# EAGLE design Ultraschall Sensoren_85_SMD (EAGLE 7.2.0)
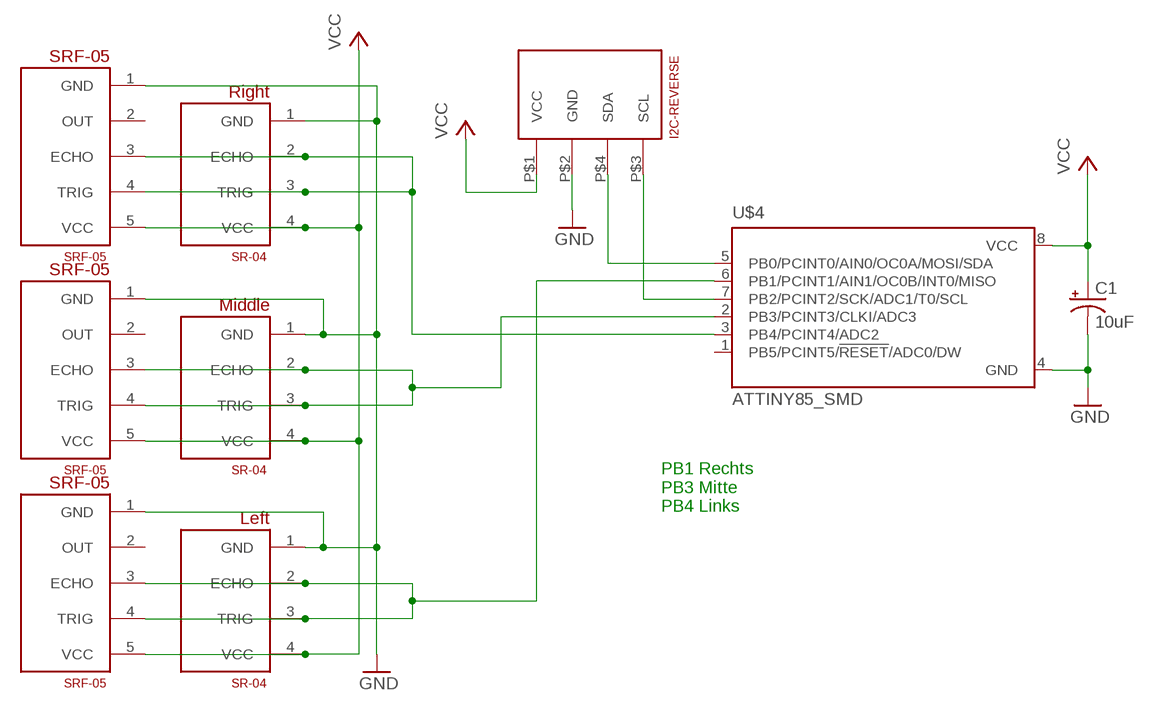
[diagram p0: schematic, sheet 1]

## Parts
C1  10uF  10UF-TANT  [EIA3216]
LINKS  Left  SR-04  [HC-SR04]
MIDDLE  Middle  SR-04  [HC-SR04]
RIGHT  Right  SR-04  [HC-SR04]
U$1  SRF-05  [SRF-05]
U$2  I2C-REVERSE  [I2C-CONNECTOR]
U$3  SRF-05  [SRF-05]
U$4  ATTINY85_SMD  [ATTINY85_SMD]
U$5  SRF-05  [SRF-05]

## Nets
GND: C1.C(-) LINKS.1(GND) MIDDLE.1(GND) RIGHT.1(GND) U$1.1(GND) U$2.P$2(GND) U$3.1(GND) U$4.4(GND) U$5.1(GND)
N$1: RIGHT.2(ECHO) RIGHT.3(TRIG) U$1.3(ECHO) U$1.4(TRIG) U$4.3(PB4/PCINT4/ADC2)
N$2: MIDDLE.2(ECHO) MIDDLE.3(TRIG) U$3.3(ECHO) U$3.4(TRIG) U$4.2(PB3/PCINT3/CLKI/ADC3)
N$4: U$2.P$3(SCL) U$4.7(PB2/PCINT2/SCK/ADC1/T0/SCL)
N$5: U$2.P$4(SDA) U$4.5(PB0/PCINT0/AIN0/OC0A/MOSI/SDA)
N$6: LINKS.2(ECHO) LINKS.3(TRIG) U$4.6(PB1/PCINT1/AIN1/OC0B/INT0/MISO) U$5.3(ECHO) U$5.4(TRIG)
VCC: C1.A(+) LINKS.4(VCC) MIDDLE.4(VCC) RIGHT.4(VCC) U$1.5(VCC) U$2.P$1(VCC) U$3.5(VCC) U$4.8(VCC) U$5.5(VCC)
Unconnected: U$1.2(OUT) U$3.2(OUT) U$4.1(PB5/PCINT5/!RESET!/ADC0/DW) U$5.2(OUT)

## Notes on the sheet
- PB1 Rechts
  PB3 Mitte
  PB4 Links

## Library data of the parts
C1 = SparkFun-Retired:10UF-TANT: 10uF Tantalum SMT CAP-00811- 16V 10% (EIA-3216); PROD_ID: CAP-00811
LINKS MIDDLE RIGHT = ASP_Library:SR-04
U$1 U$3 U$5 = ASP_Library:SRF-05
U$2 = ASP_Library:I2C-REVERSE
U$4 = ASP_Library:ATTINY85_SMD

## Board
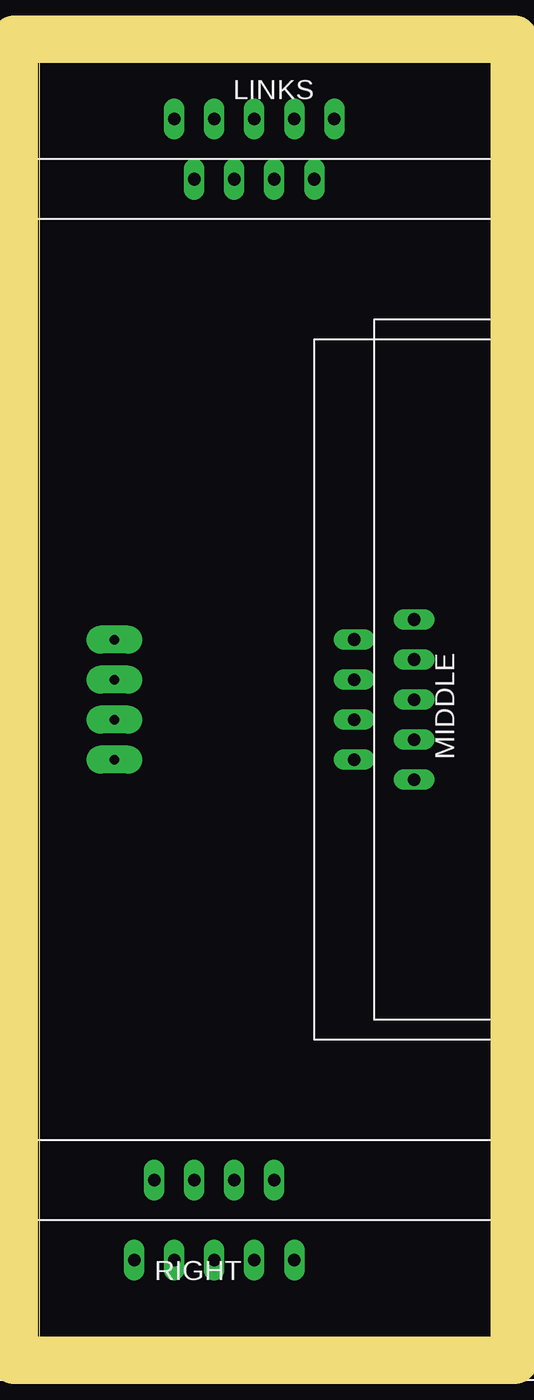
[diagram p1: board, top side]
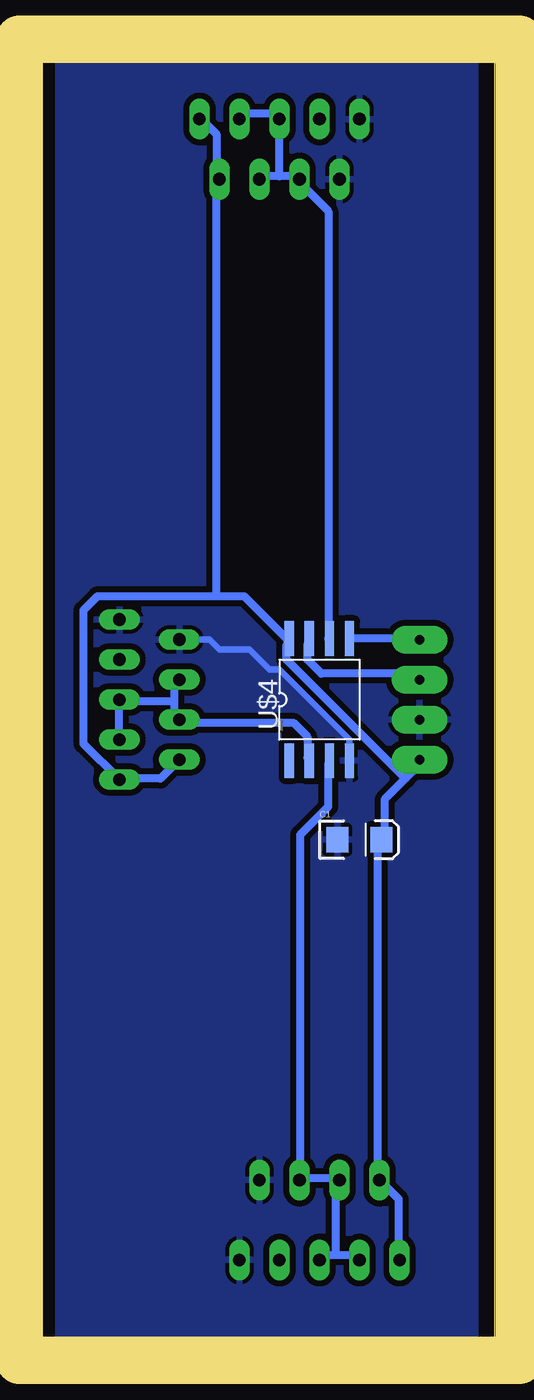
[diagram p2: board, bottom side, seen from below]

Size 28.88 x 83.8 mm. Coordinates in mm from the lower left corner, seen from the top.
Outline: 28.88,0 28.88,83.8 0,83.8 0,0 28.88,0
Copper layers (1*16): Top 0.035mm / dielectric 1.5mm / Bottom 0.035mm
Design rules "default *": minimum track width 20mil, minimum drill 24mil, track to track 15mil, track to pad 15mil, pad to pad 15mil, via to via 15mil, smd to smd 15mil, copper to edge 40mil, drill to drill 8mil, minimum pad ring 10mil, minimum via ring 8mil, stop-mask expansion 4mil, vias tented up to drill 0mil, thermal gap 10mil
Milling: 4 lines

### Footprints (pad centres in the part's own frame; a part is rotated, then mirrored left to right if it is on the bottom)
EIA3216 = smd 1.4 x 1.6: A 1.4,0; C -1.4,0
HC-SR04 = drill 0.8 long: 1 -5.08,3.81; 2 -5.08,1.27; 3 -5.08,-1.27; 4 -5.08,-3.81
SRF-05 = drill 0.8 long: 1 -5.08,3.81; 2 -5.08,1.27; 3 -5.08,-1.27; 4 -5.08,-3.81; 5 -5.08,-6.35
I2C-CONNECTOR = drill 0.6 pad 1.778 long: P$1 0,3.81; P$2 0,1.27; P$3 0,-1.27; P$4 0,-3.81
ATTINY85_SMD = smd 0.6 x 2.2: 1 -1.905,-3.87; 2 -0.635,-3.87; 3 0.635,-3.87; 4 1.905,-3.87; 5 1.905,3.87; 6 0.635,3.87; 7 -0.635,3.87; 8 -1.905,3.87

### Placement (x,y rotation side)
C1  8.56,33.02 0 bottom
LINKS  13.64,80.01 90 top
MIDDLE  25.07,41.91 0 top
RIGHT  11.1,6.35 270 top
U$1  12.37,1.27 270 top
U$2  4.75,41.91 180 top
U$3  28.88,43.18 0 top
U$4  11.1,41.91 0 bottom
U$5  12.37,83.82 90 top

### Tracks (layer width: path | path; a pad name or v marks a point on that pad's centre or on a via)
GND
  Bottom 0.406: U$4.4 9.2,39.37 13.64,43.81 14.28,43.81 15.54,45.09 17.45,45.09 18.09,45.72 MIDDLE.1
  pour Bottom: -2.87,0 -2.87,83.82 28.88,83.82 28.88,0
N$1
  Bottom 0.508: 10.08,6.67 10.97,6.67 U$1.3 | 10.08,6.67 8.75,6.67 U$1.4 | 12.31,11.56 12.31,33.34 10.53,35.12 10.53,37.78 U$4.3 | 12.31,11.56 10.08,11.56 RIGHT.3 10.08,11.11 10.08,6.67 | 12.31,11.56 RIGHT.2
N$2
  Bottom 0.508: U$3.4 23.86,39.56 23.86,41.78 U$3.3 23.42,41.78 20.31,41.78 | U$4.2 11.86,38.23 11.86,39.56 12.75,40.45 19.86,40.45 MIDDLE.3 20.31,40.89 20.31,41.78 | 20.31,41.78 20.31,43.12 MIDDLE.2
N$4
  Bottom 0.508: U$4.7 11.86,45.34 11.86,44.45 10.97,43.56 4.75,43.56 U$2.P$3
N$5
  Bottom 0.508: U$4.5 4.75,45.78 U$2.P$4
N$6
  Bottom 0.508: U$5.4 15.86,79.12 13.64,79.12 U$5.3 13.64,75.12 | U$4.6 10.53,45.78 10.53,72.9 12.31,74.68 LINKS.2 12.75,75.12 13.64,75.12 | 13.64,75.12 14.53,75.12 LINKS.3
VCC
  Bottom 0.508: U$1.5 6.08,6.67 6.08,10.22 RIGHT.4 7.42,11.56 7.42,32.89 C1.A 6.97,33.34 6.97,35.56 5.64,36.89 | U$5.5 18.53,78.68 17.64,77.79 17.64,75.12 LINKS.4 17.64,74.68 17.64,48.45 | MIDDLE.4 21.2,36.89 23.42,36.89 U$3.5 26.09,39.12 26.09,47.56 25.2,48.45 17.64,48.45 | 5.64,36.89 4.75,37.78 U$2.P$1 | 5.64,36.89 13.2,44.45 13.2,45.34 U$4.8 13.2,45.78 15.86,48.45 17.64,48.45